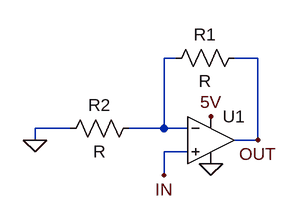
[diagram p0: schematic Opamp1_test.asc]
Opamp1_test.asc, the LTspice schematic file:
Version 4.1
SHEET 1 880 680
WIRE 160 48 144 48
WIRE 272 48 240 48
WIRE 16 144 -32 144
WIRE 144 144 144 48
WIRE 144 144 96 144
WIRE 176 144 144 144
WIRE -32 160 -32 144
WIRE 272 160 272 48
WIRE 272 160 240 160
WIRE 176 176 144 176
WIRE 144 208 144 176
FLAG -32 160 0
FLAG 208 128 5V
FLAG 208 192 0
FLAG 144 208 IN
FLAG 272 160 OUT
SYMBOL OpAmps\\UniversalOpAmp 208 160 R0
SYMATTR InstName U1
SYMBOL res 256 32 R90
WINDOW 0 0 56 VBottom 2
WINDOW 3 32 56 VTop 2
SYMATTR InstName R1
SYMBOL res 112 128 R90
WINDOW 0 0 56 VBottom 2
WINDOW 3 32 56 VTop 2
SYMATTR InstName R2

The netlist it stands for:
* Opamp1_test.asc
X§U1 IN N001 5V 0 OUT level1 Avol=1Meg GBW=10Meg Vos=0 En=0 Enk=0 In=0 Ink=0 Rin=500Meg  ; pins In+ In- V+ V- OUT
R1 OUT N001 R
R2 N001 0 R
.lib UniversalOpAmp1.lib
.backanno
.end